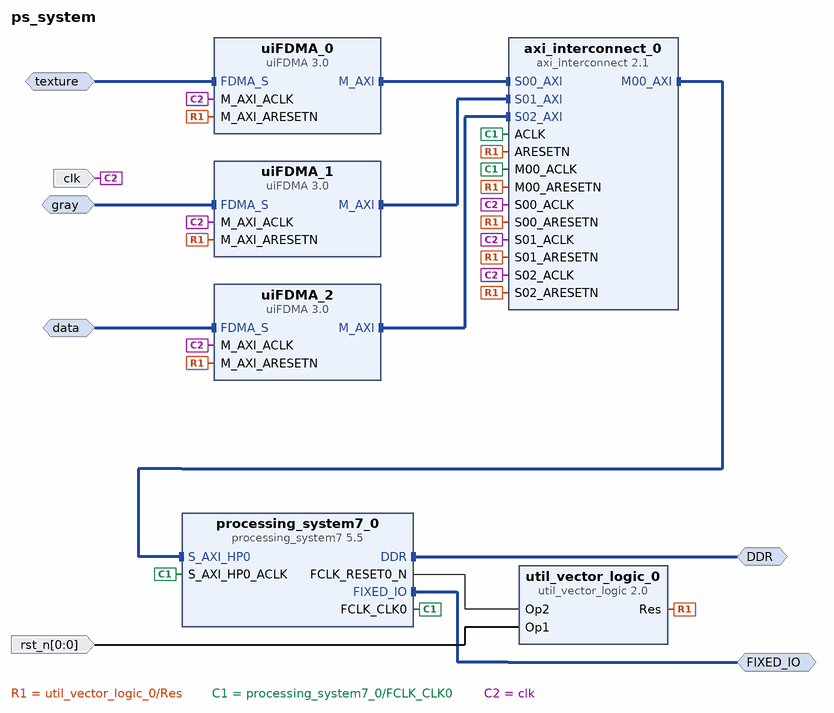
[diagram p0: block diagram of the top level]
# Vivado block design ps_system, xc7z010clg400-1, Vivado 2020.2
create_bd_design ps_system

create_bd_intf_port -mode Master -vlnv xilinx.com:interface:ddrx_rtl:1.0 DDR
create_bd_intf_port -mode Master -vlnv xilinx.com:display_processing_system7:fixedio_rtl:1.0 FIXED_IO
create_bd_intf_port -mode Slave -vlnv xilinx.com:user:FDMA_S_rtl:1.0 gray
create_bd_intf_port -mode Slave -vlnv xilinx.com:user:FDMA_S_rtl:1.0 texture
create_bd_intf_port -mode Slave -vlnv xilinx.com:user:FDMA_S_rtl:1.0 data
create_bd_port -dir I -from 0 -to 0 rst_n
create_bd_port -dir I -type clk clk

create_bd_cell -type ip -vlnv xilinx.com:ip:processing_system7:5.5 processing_system7_0
set_property -dict [list \
  CONFIG.PCW_FCLK_CLK0_BUF FALSE \
  CONFIG.PCW_FPGA0_PERIPHERAL_FREQMHZ 100 \
  CONFIG.PCW_SD0_GRP_CD_ENABLE 0 \
  CONFIG.PCW_SD0_GRP_WP_ENABLE 0 \
  CONFIG.PCW_SD0_PERIPHERAL_ENABLE 1 \
  CONFIG.PCW_SD0_SD0_IO {MIO 40 .. 45} \
  CONFIG.PCW_SDIO_PERIPHERAL_FREQMHZ 100 \
  CONFIG.PCW_UART1_PERIPHERAL_ENABLE 1 \
  CONFIG.PCW_UART1_UART1_IO {MIO 24 .. 25} \
  CONFIG.PCW_UART_PERIPHERAL_FREQMHZ 100 \
  CONFIG.PCW_UIPARAM_DDR_BUS_WIDTH {16 Bit} \
  CONFIG.PCW_UIPARAM_DDR_PARTNO Custom \
  CONFIG.PCW_USE_M_AXI_GP0 0 \
  CONFIG.PCW_USE_S_AXI_HP0 1 \
] [get_bd_cells processing_system7_0]
# 86 more settings of processing_system7_0 are not shown: defaults, MIO pin electricals, DDR timing, and values the tool derives
create_bd_cell -type ip -vlnv xilinx.com:ip:axi_interconnect:2.1 axi_interconnect_0
set_property -dict [list \
  CONFIG.M00_HAS_DATA_FIFO 2 \
  CONFIG.M00_HAS_REGSLICE 1 \
  CONFIG.NUM_MI 1 \
  CONFIG.NUM_SI 3 \
  CONFIG.S00_HAS_DATA_FIFO 2 \
  CONFIG.S00_HAS_REGSLICE 1 \
  CONFIG.S01_HAS_DATA_FIFO 2 \
  CONFIG.S01_HAS_REGSLICE 1 \
  CONFIG.S02_HAS_DATA_FIFO 2 \
  CONFIG.S02_HAS_REGSLICE 1 \
  CONFIG.S03_HAS_DATA_FIFO 0 \
  CONFIG.S03_HAS_REGSLICE 0 \
  CONFIG.S04_HAS_DATA_FIFO 0 \
  CONFIG.S04_HAS_REGSLICE 0 \
] [get_bd_cells axi_interconnect_0]
create_bd_cell -type ip -vlnv xilinx.com:user:uiFDMA:3.0 uiFDMA_0
set_property -dict {CONFIG.M_AXI_DATA_WIDTH 64 CONFIG.M_AXI_ID 0 CONFIG.M_AXI_ID_WIDTH 2} [get_bd_cells uiFDMA_0]
create_bd_cell -type ip -vlnv xilinx.com:user:uiFDMA:3.0 uiFDMA_1
set_property -dict {CONFIG.M_AXI_DATA_WIDTH 64 CONFIG.M_AXI_ID 1 CONFIG.M_AXI_ID_WIDTH 2} [get_bd_cells uiFDMA_1]
create_bd_cell -type ip -vlnv xilinx.com:user:uiFDMA:3.0 uiFDMA_2
set_property -dict {CONFIG.M_AXI_DATA_WIDTH 64 CONFIG.M_AXI_ID 2 CONFIG.M_AXI_ID_WIDTH 2} [get_bd_cells uiFDMA_2]
create_bd_cell -type ip -vlnv xilinx.com:ip:util_vector_logic:2.0 util_vector_logic_0
set_property -dict {CONFIG.C_SIZE 1} [get_bd_cells util_vector_logic_0]

# ---- connections ----

connect_bd_intf_net [get_bd_intf_ports DDR] [get_bd_intf_pins processing_system7_0/DDR]
connect_bd_intf_net -intf_net FDMA_S_1_1 [get_bd_intf_ports texture] [get_bd_intf_pins uiFDMA_0/FDMA_S]
connect_bd_intf_net -intf_net FDMA_S_0_1 [get_bd_intf_ports gray] [get_bd_intf_pins uiFDMA_1/FDMA_S]
connect_bd_intf_net [get_bd_intf_ports FIXED_IO] [get_bd_intf_pins processing_system7_0/FIXED_IO]
connect_bd_intf_net [get_bd_intf_ports data] [get_bd_intf_pins uiFDMA_2/FDMA_S]
connect_bd_intf_net [get_bd_intf_pins uiFDMA_2/M_AXI] [get_bd_intf_pins axi_interconnect_0/S02_AXI]
connect_bd_intf_net [get_bd_intf_pins uiFDMA_0/M_AXI] [get_bd_intf_pins axi_interconnect_0/S00_AXI]
connect_bd_intf_net [get_bd_intf_pins uiFDMA_1/M_AXI] [get_bd_intf_pins axi_interconnect_0/S01_AXI]
connect_bd_intf_net [get_bd_intf_pins axi_interconnect_0/M00_AXI] [get_bd_intf_pins processing_system7_0/S_AXI_HP0]
connect_bd_net -net M_AXI_ARESETN_0_1 [get_bd_pins util_vector_logic_0/Res] \
  [get_bd_pins uiFDMA_0/M_AXI_ARESETN] [get_bd_pins uiFDMA_1/M_AXI_ARESETN] [get_bd_pins uiFDMA_2/M_AXI_ARESETN] \
  [get_bd_pins axi_interconnect_0/ARESETN] [get_bd_pins axi_interconnect_0/S00_ARESETN] \
  [get_bd_pins axi_interconnect_0/M00_ARESETN] [get_bd_pins axi_interconnect_0/S01_ARESETN] \
  [get_bd_pins axi_interconnect_0/S02_ARESETN]
connect_bd_net [get_bd_pins processing_system7_0/FCLK_CLK0] \
  [get_bd_pins axi_interconnect_0/ACLK] [get_bd_pins axi_interconnect_0/M00_ACLK] \
  [get_bd_pins processing_system7_0/S_AXI_HP0_ACLK]
connect_bd_net -net Op1_0_1 [get_bd_ports rst_n] [get_bd_pins util_vector_logic_0/Op1]
connect_bd_net [get_bd_pins processing_system7_0/FCLK_RESET0_N] [get_bd_pins util_vector_logic_0/Op2]
connect_bd_net -net M_AXI_ACLK_0_1 [get_bd_ports clk] \
  [get_bd_pins uiFDMA_0/M_AXI_ACLK] [get_bd_pins uiFDMA_1/M_AXI_ACLK] [get_bd_pins uiFDMA_2/M_AXI_ACLK] \
  [get_bd_pins axi_interconnect_0/S02_ACLK] [get_bd_pins axi_interconnect_0/S01_ACLK] \
  [get_bd_pins axi_interconnect_0/S00_ACLK]

# ---- address map ----
assign_bd_address -offset 0x00000000 -range 256M -target_address_space [get_bd_addr_spaces uiFDMA_0/M_AXI] [get_bd_addr_segs processing_system7_0/S_AXI_HP0/HP0_DDR_LOWOCM]
assign_bd_address -offset 0x00000000 -range 256M -target_address_space [get_bd_addr_spaces uiFDMA_1/M_AXI] [get_bd_addr_segs processing_system7_0/S_AXI_HP0/HP0_DDR_LOWOCM]
assign_bd_address -offset 0x00000000 -range 256M -target_address_space [get_bd_addr_spaces uiFDMA_2/M_AXI] [get_bd_addr_segs processing_system7_0/S_AXI_HP0/HP0_DDR_LOWOCM]

validate_bd_design
save_bd_design
